# EAGLE design ARM-LPC1115_V0.18_smd (EAGLE 6.5.0)
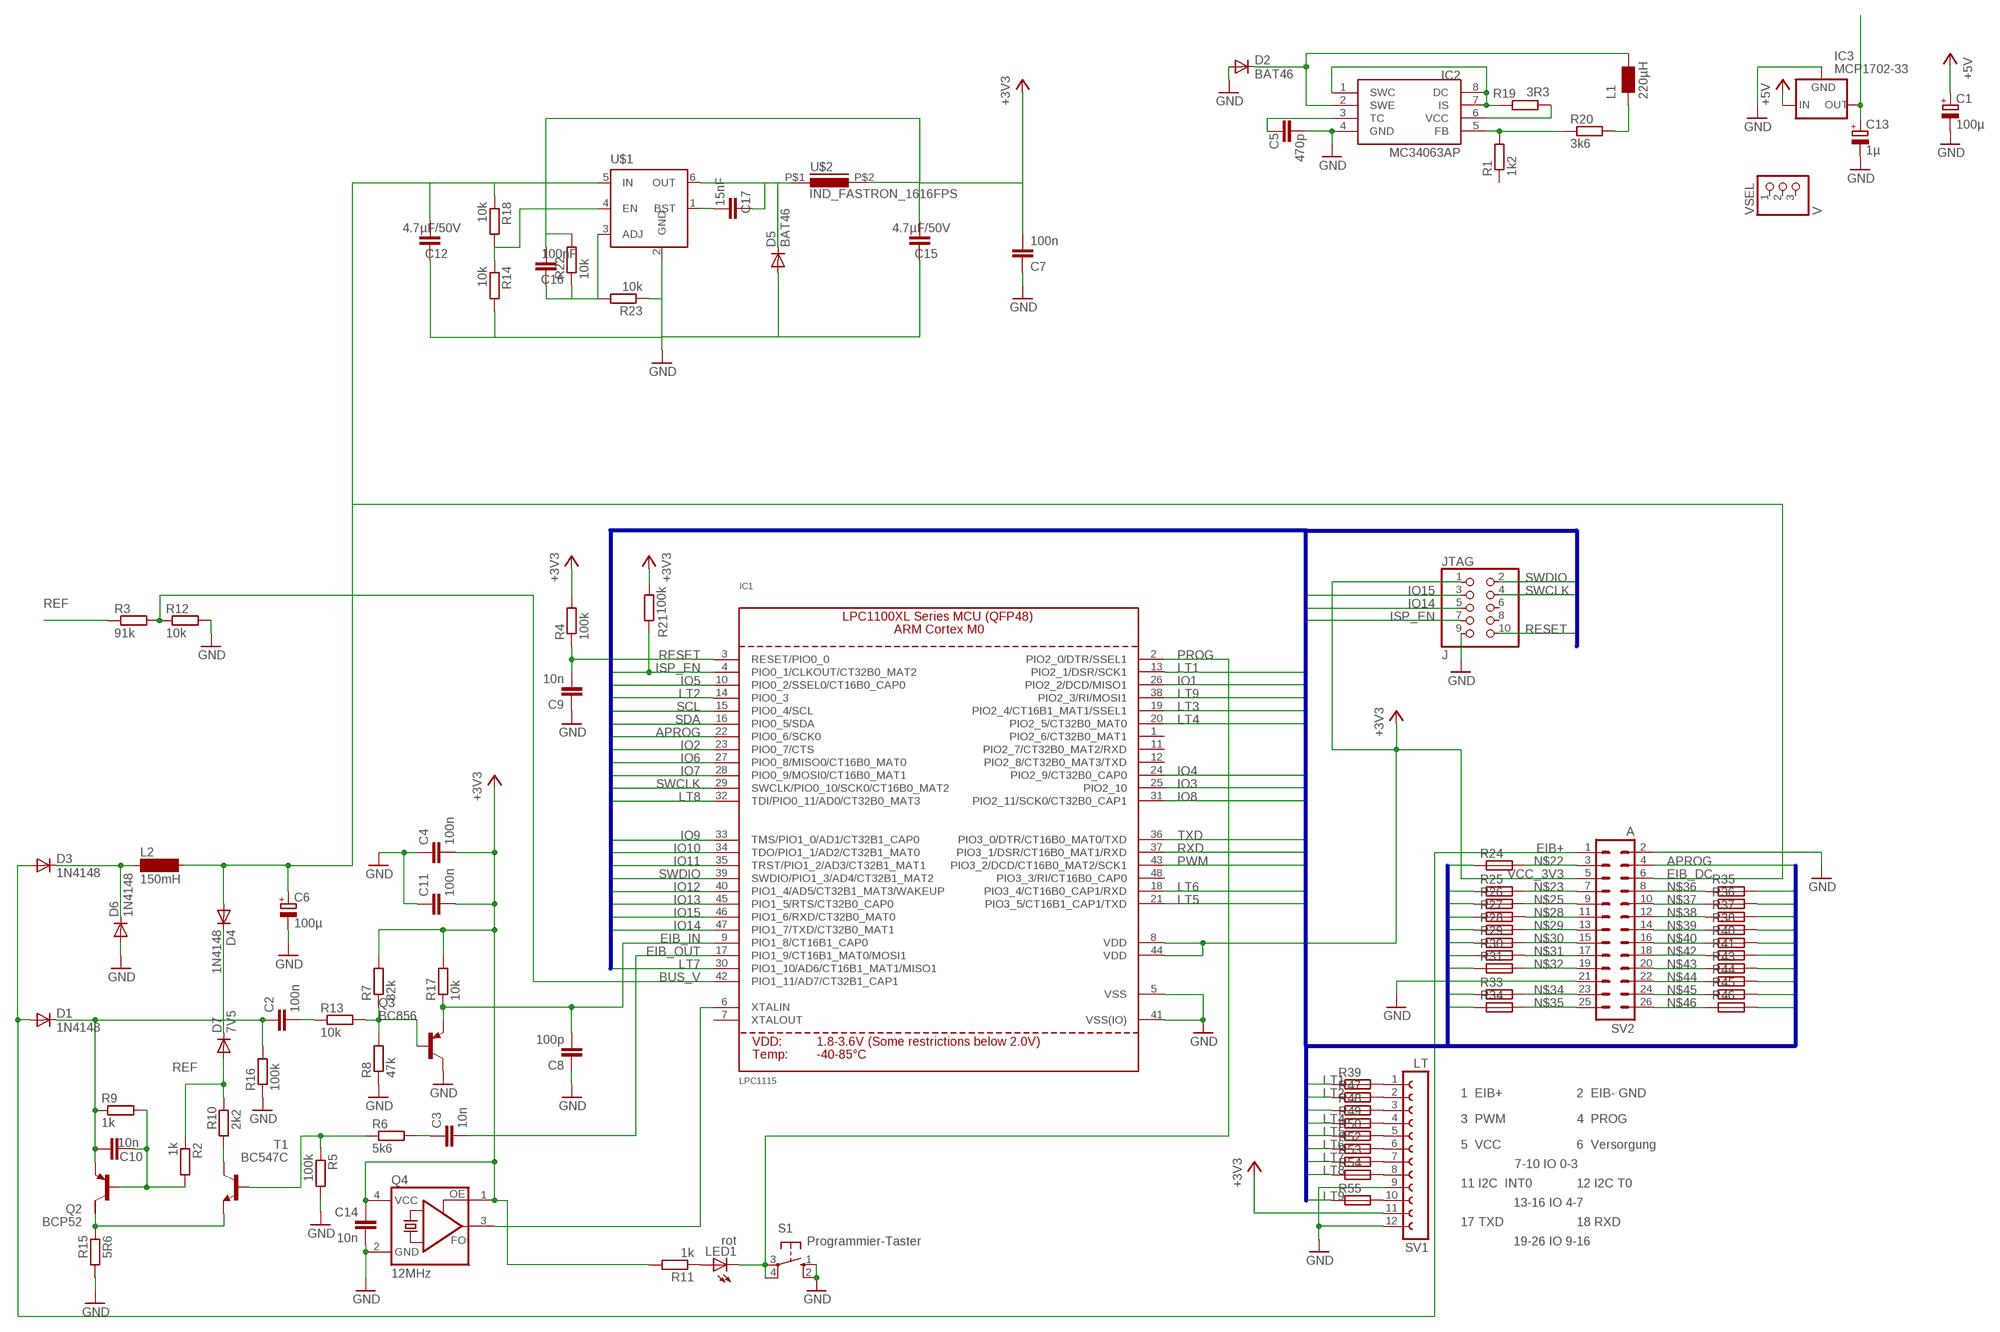
[diagram p0: schematic, sheet 1]

## Parts
C1  100µ  CPOL-EUE5-8.5  [E5-8,5]
C2  100n  C-EUC1206K  [C1206K]
C3  10n  C-EUC1206K  [C1206K]
C4  100n  C-EUC1206  [C1206]
C5  470p  C-EU025-024X044  [C025-024X044]
C6  100µ  CPOL-EUE5-8.5  [E5-8,5]
C7  100n  C-EUC1206  [C1206]
C8  100p  C-EUC1206K  [C1206K]
C9  10n  C-EUC1206K  [C1206K]
C10  10n  C-EUC1206K  [C1206K]
C11  100n  C-EUC1206  [C1206]
C12  4.7µF/50V  C-EUC1206K  [C1206K]
C13  1µ  CPOL-EUE2-4  [E2-4]
C14  10n  C-EUC1206  [C1206]
C15  4.7µF/50V  C-EUC1206K  [C1206K]
C16  100nF  C-EUC1206  [C1206]
C17  15nF  C-EUC1206  [C1206]
D1  1N4148  DIODE-MINIMELF  [MINIMELF]
D2  BAT46  DIODE-D-7.5  [D-7.5]
D3  1N4148  DIODE-MINIMELF  [MINIMELF]
D4  1N4148  DIODE-MINIMELF  [MINIMELF]
D5  BAT46  DIODE-DO214AC  [DO214AC]
D6  1N4148  DIODE-MINIMELF  [MINIMELF]
D7  7V5  DIODE-MINIMELF  [MINIMELF]
IC1  LPC1115  LPC1113/4/5_QFP48_XLSERIES  [LQFP48]
IC2  MC34063AP  [DIL08]
IC3  MCP1702-33  79LXX  [79LXX]
JTAG  J  PINHD-2X05_2.00  [2X05M]
L1  220µH  L_R85  [L_RAD_D8RM5]
L2  150mH  SD12-1000  [SD12_1000]
LED1  rot  LED3MM  [LED3MM]
Q2  BCP52  FZT753SMD  [SOT223]
Q3  BC856  BC856BSMD  [SOT23-BEC]
Q4  12MHz  ASFL  [ASF]
R1  1k2  R-EU_0207/10  [0207/10]
R2  1k  R-EU_R1206  [R1206]
R3  91k  R-EU_R1206  [R1206]
R4  100k  R-EU_R1206  [R1206]
R5  100k  R-EU_R1206  [R1206]
R6  5k6  R-EU_R1206  [R1206]
R7  82k  R-EU_R1206  [R1206]
R8  47k  R-EU_R1206  [R1206]
R9  1k  R-EU_R1206  [R1206]
R10  2k2  R-EU_R1206  [R1206]
R11  1k  R-EU_R1206  [R1206]
R12  10k  R-EU_R1206  [R1206]
R13  10k  R-EU_R1206  [R1206]
R14  10k  R-EU_R1206  [R1206]
R15  5R6  R-EU_R1206  [R1206]
R16  100k  R-EU_R1206  [R1206]
R17  10k  R-EU_R1206  [R1206]
R18  10k  R-EU_R1206  [R1206]
R19  3R3  R-EU_0207/10  [0207/10]
R20  3k6  R-EU_0207/10  [0207/10]
R21  100k  R-EU_R1206  [R1206]
R22  10k  R-EU_R1206  [R1206]
R23  10k  R-EU_R1206  [R1206]
R24  R-EU_BRIDGER0603  [R0603_BRIDGE]
R25  R-EU_BRIDGER0603  [R0603_BRIDGE]
R26  R-EU_BRIDGER0603  [R0603_BRIDGE]
R27  R-EU_BRIDGER0603  [R0603_BRIDGE]
R28  R-EU_BRIDGER0603  [R0603_BRIDGE]
R29  R-EU_BRIDGER0603  [R0603_BRIDGE]
R30  R-EU_BRIDGER0603  [R0603_BRIDGE]
R31  R-EU_BRIDGER0603  [R0603_BRIDGE]
R33  R-EU_BRIDGER0603  [R0603_BRIDGE]
R34  R-EU_BRIDGER0603  [R0603_BRIDGE]
R35  R-EU_BRIDGER0603  [R0603_BRIDGE]
R36  R-EU_BRIDGER0603  [R0603_BRIDGE]
R37  R-EU_BRIDGER0603  [R0603_BRIDGE]
R38  R-EU_BRIDGER0603  [R0603_BRIDGE]
R39  R-EU_BRIDGER0603  [R0603_BRIDGE]
R40  R-EU_BRIDGER0603  [R0603_BRIDGE]
R41  R-EU_BRIDGER0603  [R0603_BRIDGE]
R43  R-EU_BRIDGER0603  [R0603_BRIDGE]
R44  R-EU_BRIDGER0603  [R0603_BRIDGE]
R45  R-EU_BRIDGER0603  [R0603_BRIDGE]
R46  R-EU_BRIDGER0603  [R0603_BRIDGE]
R47  R-EU_BRIDGER0603  [R0603_BRIDGE]
R48  R-EU_BRIDGER0603  [R0603_BRIDGE]
R49  R-EU_BRIDGER0603  [R0603_BRIDGE]
R50  R-EU_BRIDGER0603  [R0603_BRIDGE]
R52  R-EU_BRIDGER0603  [R0603_BRIDGE]
R53  R-EU_BRIDGER0603  [R0603_BRIDGE]
R54  R-EU_BRIDGER0603  [R0603_BRIDGE]
R55  R-EU_BRIDGER0603  [R0603_BRIDGE]
S1  Programmier-Taster  10-XX  [B3F-10XX]
SV1  LT  FE12-1  [FE12]
SV2  A  ML26  [ML26]
T1  BC547C  BC847  [SOT23]
U$1  BD9G101GBD9G101G-SOT23-6  [SOT23-6]
U$2  IND_FASTRON_1616FPS  [PIS2812]
VSEL  V  HEADER-1X3ROUND  [1X03_ROUND]

## Nets
+5V: C1.+
APROG: IC1.22(PIO0_6/SCK0) SV2.4
BUS_V: IC1.42(PIO1_11/AD7/CT32B1_CAP1) R3.2 R12.1
DRAIN: C2.1 C10.1 D1.C Q2.3(E) R9.1 R16.2
EIB+: D1.A D3.A SV2.1
EIB_DC: C6.+ C12.2 D4.A L2.2 R18.1 SV2.6 U$1.5(IN)
EIB_IN: C8.2 IC1.9(PIO1_8/CT16B1_CAP0) Q3.E R17.1
EIB_OUT: C3.2 IC1.17(PIO1_9/CT16B1_MAT0/MOSI1)
GND: C1.- C4.1 C5.2 C6.- C7.1 C8.1 C9.1 C11.1 C12.1 C13.- C14.2 C15.1 D2.A D5.A D6.A IC1.5(VSS) IC1.41(VSS(IO)) IC2.4(GND) IC3.GND JTAG.9 Q3.C Q4.2(GND) R5.2 R8.1 R12.2 R14.2 R15.1 R16.1 R23.1 S1.1(S) S1.2(S1) SV1.9 SV1.12 SV2.2 SV2.21 U$1.2(GND)
IO1: IC1.26(PIO2_2/DCD/MISO1) R25.1
IO2: IC1.23(PIO0_7/CTS) R35.2
IO3: IC1.25(PIO2_10) R26.1
IO4: IC1.24(PIO2_9/CT32B0_CAP0) R36.2
IO5: IC1.10(PIO0_2/SSEL0/CT16B0_CAP0) R28.1
IO6: IC1.27(PIO0_8/MISO0/CT16B0_MAT0) R38.2
IO7: IC1.28(PIO0_9/MOSI0/CT16B0_MAT1) R29.1
IO8: IC1.31(PIO2_11/SCK0/CT32B0_CAP1) R40.2
IO9: IC1.33(TMS/PIO1_0/AD1/CT32B1_CAP0) R31.1
IO10: IC1.34(TDO/PIO1_1/AD2/CT32B1_MAT0) R43.2
IO11: IC1.35(TRST/PIO1_2/AD3/CT32B1_MAT1) R44.2
IO12: IC1.40(PIO1_4/AD5/CT32B1_MAT3/WAKEUP) R33.1
IO13: IC1.45(PIO1_5/RTS/CT32B0_CAP0) R45.2
IO14: IC1.47(PIO1_7/TXD/CT32B0_MAT1) JTAG.5 R34.1
IO15: IC1.46(PIO1_6/RXD/CT32B0_MAT0) JTAG.3 R46.2
ISP_EN: IC1.4(PIO0_1/CLKOUT/CT32B0_MAT2) JTAG.7 R21.1
LT1: IC1.13(PIO2_1/DSR/SCK1) R39.1
LT2: IC1.14(PIO0_3) R47.1
LT3: IC1.19(PIO2_4/CT16B1_MAT1/SSEL1) R48.1
LT4: IC1.20(PIO2_5/CT32B0_MAT0) R49.1
LT5: IC1.21(PIO3_5/CT16B1_CAP1/TXD) R50.1
LT6: IC1.18(PIO3_4/CT16B0_CAP1/RXD) R52.1
LT7: IC1.30(PIO1_10/AD6/CT16B1_MAT1/MISO1) R53.1
LT8: IC1.32(TDI/PIO0_11/AD0/CT32B0_MAT3) R54.1
LT9: IC1.38(PIO2_3/RI/MOSI1) R55.1
LX: C17.1 D5.C U$1.6(OUT) U$2.P$1
N$1: C3.1 R6.2
N$2: C2.2 R13.1
N$3: IC2.5(FB) R1.2 R20.1
N$4: IC2.1(SWC) IC2.7(IS) IC2.8(DC) R19.1
N$6: R10.1 T1.3(C)
N$7: Q2.2(C) R15.2 T1.2(E)
N$8: D3.C D6.C L2.1
N$9: D4.C D7.C
N$10: D2.C IC2.2(SWE) L1.1
N$11: IC2.6(VCC) R19.2
N$12: R5.1 R6.1 T1.1(B)
N$13: C5.1 IC2.3(TC)
N$14: Q3.B R7.1 R8.2 R13.2
N$15: C10.2 Q2.1(B) R2.2 R9.2
N$16: C13.+ IC3.OUT
N$17: IC1.6(XTALIN) Q4.3(FO)
N$19: C17.2 U$1.1(BST)
N$20: R14.1 R18.2 U$1.4(EN)
N$22: R24.2 SV2.3
N$23: R25.2 SV2.7
N$24: C16.1 R22.1 R23.2 U$1.3(ADJ)
N$25: R26.2 SV2.9
N$28: R27.2 SV2.11
N$29: R28.2 SV2.13
N$30: R29.2 SV2.15
N$31: R30.2 SV2.17
N$32: R31.2 SV2.19
N$34: R33.2 SV2.23
N$35: R34.2 SV2.25
N$36: R35.1 SV2.8
N$37: R36.1 SV2.10
N$38: R37.1 SV2.12
N$39: R38.1 SV2.14
N$40: R40.1 SV2.16
N$41: LED1.A R11.1
N$42: R41.1 SV2.18
N$43: R43.1 SV2.20
N$44: R44.1 SV2.22
N$45: R45.1 SV2.24
N$46: R46.1 SV2.26
N$47: R39.2 SV1.1
N$48: R47.2 SV1.2
N$49: R48.2 SV1.3
N$50: R49.2 SV1.4
N$51: R50.2 SV1.5
N$52: R52.2 SV1.6
N$53: R53.2 SV1.7
N$54: R54.2 SV1.8
N$55: R55.2 SV1.10
PROG: IC1.2(PIO2_0/DTR/SSEL1) LED1.K(C) S1.3(P) S1.4(P1)
PWM: IC1.43(PIO3_2/DCD/CT16B0_MAT2/SCK1) R24.1
REF: D7.A R2.1 R3.1 R10.2
RESET: C9.2 IC1.3(RESET/PIO0_0) JTAG.10 R4.1
RXD: IC1.37(PIO3_1/DSR/CT16B0_MAT1/RXD) R41.2
SCL: IC1.15(PIO0_4/SCL) R37.2
SDA: IC1.16(PIO0_5/SDA) R27.1
SWCLK: IC1.29(SWCLK/PIO0_10/SCK0/CT16B0_MAT2) JTAG.4
SWDIO: IC1.39(SWDIO/PIO1_3/AD4/CT32B1_MAT2) JTAG.2
TXD: IC1.36(PIO3_0/DTR/CT16B0_MAT0/TXD) R30.1
VCC_3V3: C4.2 C7.2 C11.2 C14.1 C15.2 C16.2 IC1.8(VDD) IC1.44(VDD) JTAG.1 Q4.1(OE) Q4.4(VCC) R4.2 R7.2 R11.2 R17.2 R21.2 R22.2 SV1.11 SV2.5 U$2.P$2 ; supply symbol labelled +3V3
VCC_5V: IC3.IN L1.2 R20.2 ; supply symbol labelled +5V
Unconnected: IC1.1(PIO2_6/CT32B0_MAT1) IC1.7(XTALOUT) IC1.11(PIO2_7/CT32B0_MAT2/RXD) IC1.12(PIO2_8/CT32B0_MAT3/TXD) IC1.48(PIO3_3/RI/CT16B0_CAP0) JTAG.6 JTAG.8 Q2.4(C/) R1.1 VSEL.1 VSEL.2 VSEL.3

## Buses
IO[1..15],LT[1..9],SCL,SDA,PWM,APROG,RXD,TXD,RESET,SWCLK,SWDIO,ISP_EN

## Notes on the sheet
- 1  EIB+ | 2  EIB- GND
- 3  PWM | 4  PROG
- 5  VCC | 6  Versorgung
- 7-10 IO 0-3
- 11 I2C  INT0 | 12 I2C T0
- 13-16 IO 4-7
- 17 TXD | 18 RXD
- 19-26 IO 9-16

## Library data of the parts
C1 C6 C13 = rcl:CPOL-EU: POLARIZED CAPACITOR, European symbol
C2-C5 C7-C12 C14-C17 = rcl:C-EU: CAPACITOR, European symbol
D1-D7 = diode:DIODE-: DIODE
IC1 = microbuilder:LPC1113/4/5_QFP48_XLSERIES: LPC1113/4/5 ARM Cortex M0 MCU (50MHz) - XL Series (FBD48/3x3) LPC1115FBD48/303: Max Frequency: 50MHz Flash: 64kB SRAM: 8kB ADC: 10-bit
IC2 = mc34063:MC34063
IC3 = v-reg:79LXX: VOLTAGE REGULATOR
JTAG = pinhead-2:PINHD-2X05: PIN HEADER
L1 = fbctrls1:L
L2 = inductor-neosid:SD12: INDUCTOR nominal inductance
LED1 = led:LED: LED OSRAM: - CHIPLED LG R971, LG N971, LY N971, LG Q971, LY Q971, LO R971, LY R971 LH N974, LH R974 LS Q976, LO Q976, LY Q976 LO Q996 - Hyper CHIPLED LW Q18S LB Q993, LB Q99A, LB R99A - SideLED LS A670, LO A670, LY A670, LG A670, LP A670 LB A673, LV A673, LT A673, LW A673 LH A674 LY A675 LS A676, LA A676, LO A676, LY A676, LW A676 LS A679, LY A679, LG A679 - Hyper Micro SIDELED® LS Y876, LA Y876, LO Y876, LY Y876 LT Y87S - SmartLED LW L88C, LW L88S LB L89C, LB L89S, LG L890 LS L89K, LO L89K, LY L89K LS L896, LA L896, LO L896, LY L896 - TOPLED LS T670, LO T670, LY T670, LG T670, LP T670 LSG T670, LSP T670, LSY T670, LOP T670, LYG T670 LG T671, LOG T671, LSG T671 LB T673, LV T673, LT T673, LW T673 LH T674 LS T676, LA T676, LO T676, LY T676, LB T676, LH T676, LSB T676, LW T676 LB T67C, LV T67C, LT T67C, LS T67K, LO T67K, LY T67K, LW E67C LS E67B, LA E67B, LO E67B, LY E67B, LB E67C, LV E67C, LT E67C LW T67C LS T679, LY T679, LG T679 LS T770, LO T770, LY T770, LG T770, LP T770 LB T773, LV T773, LT T773, LW T773 LH T774 LS E675, LA E675, LY E675, LS T675 LS T776, LA T776, LO T776, LY T776, LB T776 LHGB T686 LT T68C, LB T68C - Hyper Mini TOPLED® LB M676 - Mini TOPLED Santana® LG M470 LS M47K, LO M47K, LY M47K Source: http://www.osram.convergy.de - LUMILED® LXK2-PW12-R00, LXK2-PW12-S00, LXK2-PW14-U00, LXK2-PW14-V00 LXK2-PM12-R00, LXK2-PM12-S00, LXK2-PM14-U00 LXK2-PE12-Q00, LXK2-PE12-R00, LXK2-PE12-S00, LXK2-PE14-T00, LXK2-PE14-U00 LXK2-PB12-K00, LXK2-PB12-L00, LXK2-PB12-M00, LXK2-PB14-N00, LXK2-PB14-P00, LXK2-PB14-Q00 LXK2-PR12-L00, LXK2-PR12-M00, LXK2-PR14-Q00, LXK2-PR14-R00 LXK2-PD12-Q00, LXK2-PD12-R00, LXK2-PD12-S00 LXK2-PH12-R00, LXK2-PH12-S00 LXK2-PL12-P00, LXK2-PL12-Q00, LXK2-PL12-R00 Source: www.luxeon.com
Q2 = transistor-pnp:FZT753SMD: PNP Transistor
Q3 = transistor-pnp:BC856*: PNP Transistror
Q4 = crystal:ASF*: CRYSTAL CLOCK OSCILLATORS 5.0 Vdc or 3.3 Vdc - LOW PROFILE ULTRA MINIATURE CERAMIC SURFACE MOUNT Source: http://www.abracon.com/Oscillators/asf1-L-L1.pdf
R1-R23 = rcl:R-EU_: RESISTOR, European symbol
R24-R31 R33-R41 R43-R50 R52-R55 = Stefan_selfbus:R-EU_BRIDGE: RESISTOR, European symbol
S1 = switch-omron:10-XX: OMRON SWITCH
SV1 = con-lsta:FE12-1: FEMALE HEADER; OC_FARNELL: unknown; OC_NEWARK: unknown
SV2 = con-harting-ml:ML26: HARTING; OC_FARNELL: unknown; OC_NEWARK: unknown
T1 = transistor:BC847: NPN TRANSISTOR
U$1 = Stefan_selfbus:BD9G101G
U$2 = Stefan_selfbus:IND_FASTRON_1616FPS
VSEL = microbuilder:HEADER-1X3: PIN HEADER

## Board
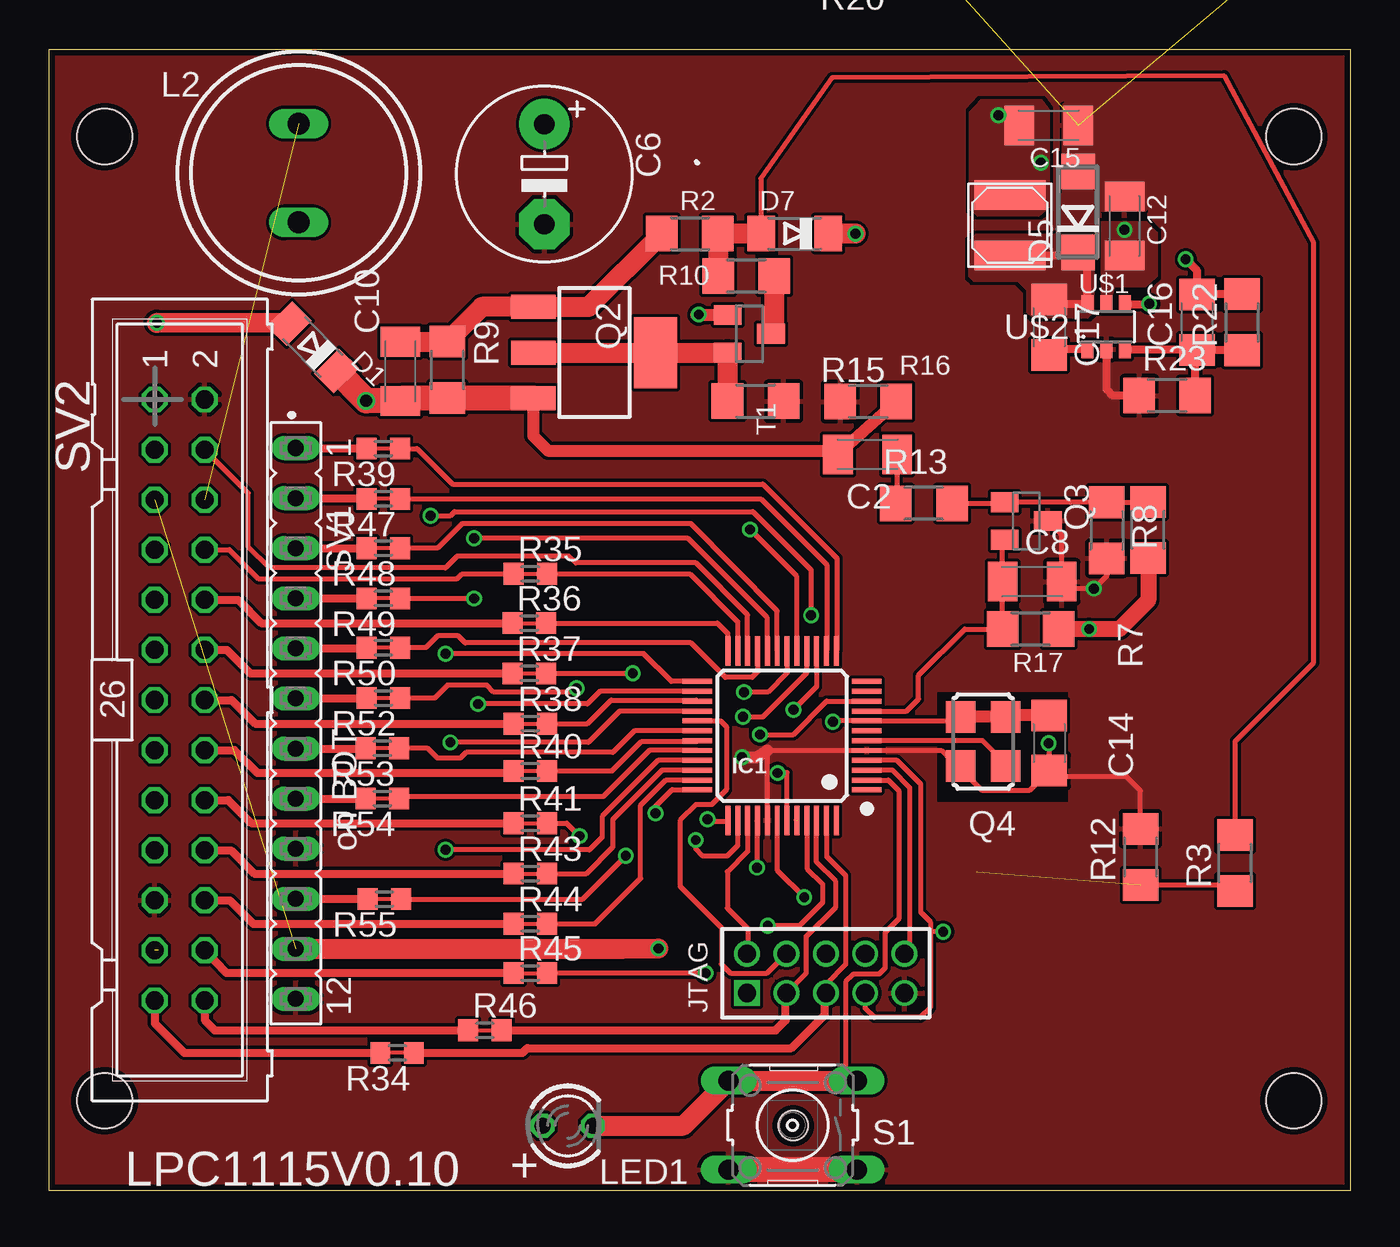
[diagram p1: board, top side]
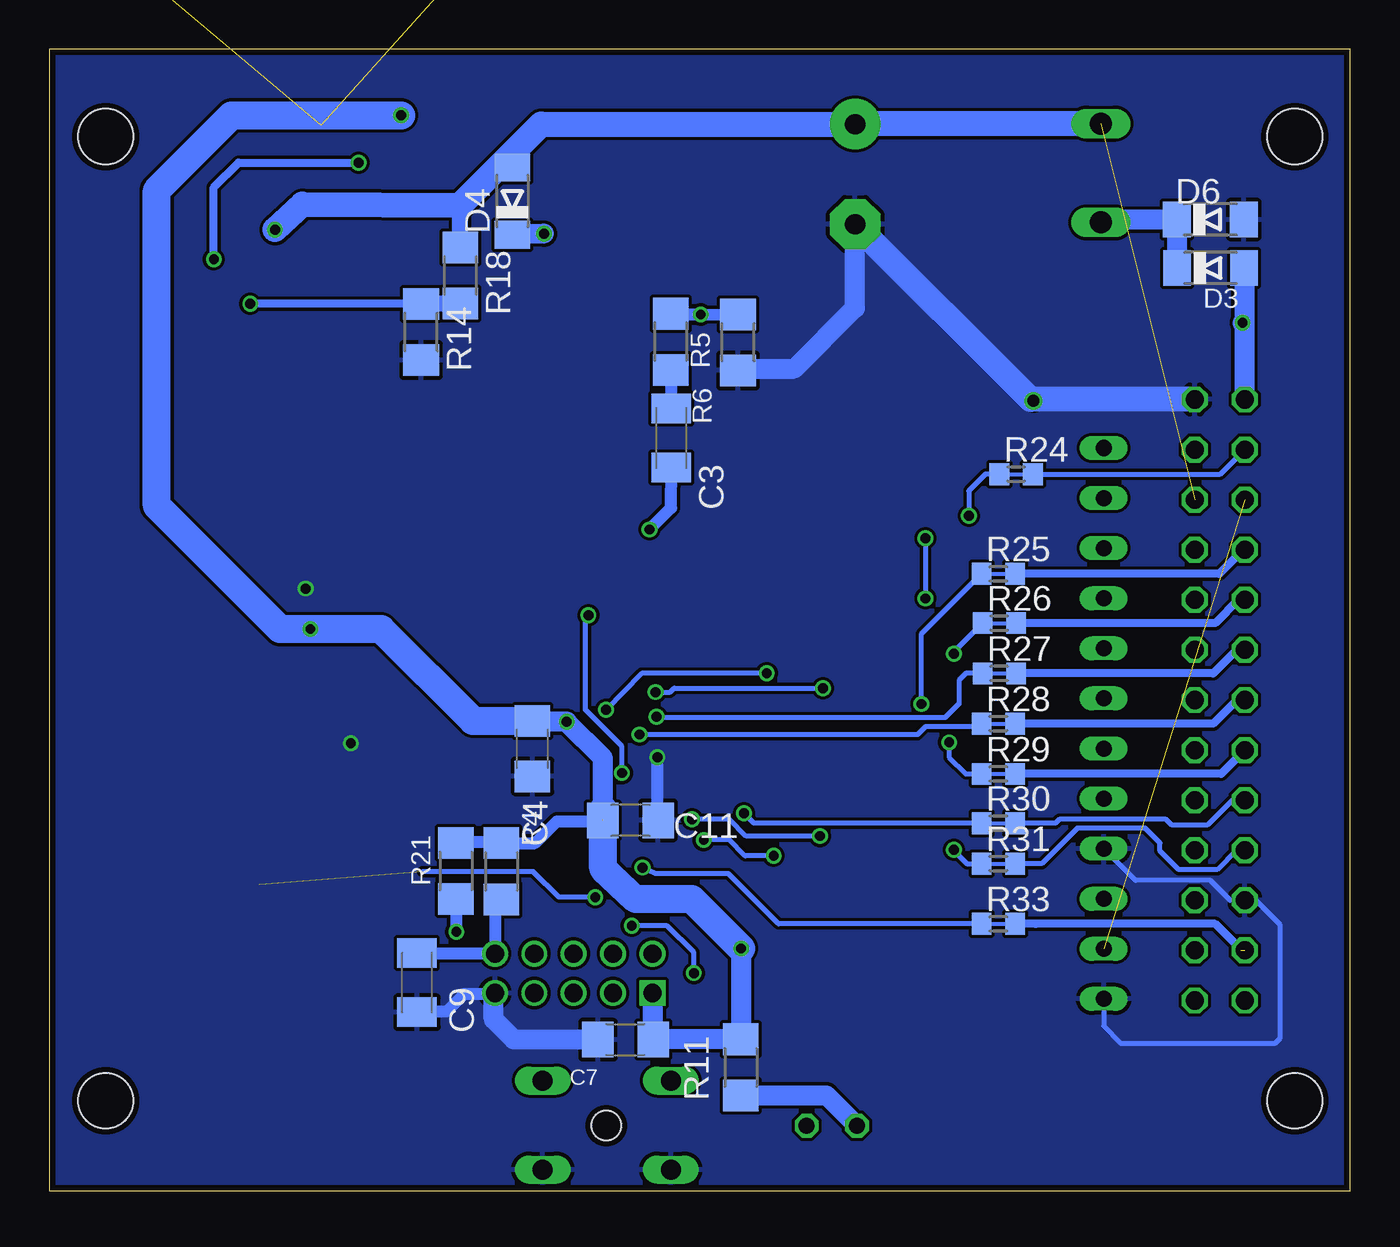
[diagram p2: board, bottom side, seen from below]

Size 66 x 57.9 mm. Coordinates in mm from the lower left corner, seen from the top.
Outline: 0,57.9 66,57.9
Outline: 0,57.9 0,0 66,0 66,57.9
Outline: 0,57.9 66,57.9
Copper layers (1*16): Top 0.035mm / dielectric 1.5mm / Bottom 0.035mm
Design rules "default *": minimum track width 0.16mm, minimum drill 0.3mm, track to track 0.16mm, track to pad 0.16mm, pad to pad 0.16mm, via to via 0.16mm, smd to smd 0.16mm, copper to edge 0.3mm, drill to drill 0.2mm, minimum pad ring 0.2mm, minimum via ring 0.15mm, stop-mask expansion 0.075mm, vias tented up to drill 0mil, thermal gap 0.2mm
Holes 2.8 mm at 2.81,53.48 63.14,53.48 63.14,4.58 2.81,4.58
Holes 1.5 mm at 37.73,3.31
tRestrict: area 45.1,19.7 to 51.7,25.3

### Footprints (pad centres in the part's own frame; a part is rotated, then mirrored left to right if it is on the bottom)
E5-8,5 = drill 1.016 pad 2.54: + -2.54,0 | drill 1.016 pad 2.54 octagon: - 2.54,0
C1206K = smd 1.5 x 2: 1 -1.5,0; 2 1.5,0
C1206 = smd 1.6 x 1.8: 1 -1.4,0; 2 1.4,0
C025-024X044 = drill 0.813 octagon: 1 -1.27,0; 2 1.27,0
E2-4 = drill 0.813 pad 1.27: + -1.016,0 | drill 0.813 pad 1.27 octagon: - 1.016,0
MINIMELF = smd 1.4 x 1.8: A 1.7,0; C -1.7,0
D-7.5 = drill 0.813 long: A 3.81,0; C -3.81,0
DO214AC = smd 1.8 x 1.7: A 2.05,0; C -2.05,0
LQFP48 = smd 1.5 x 0.25: 1 -4.3,2.75; 2 -4.3,2.25; 3 -4.3,1.75; 4 -4.3,1.25; 5 -4.3,0.75; 6 -4.3,0.25; 7 -4.3,-0.25; 8 -4.3,-0.75; 9 -4.3,-1.25; 10 -4.3,-1.75; 11 -4.3,-2.25; 12 -4.3,-2.75; 25 4.3,-2.75; 26 4.3,-2.25; 27 4.3,-1.75; 28 4.3,-1.25; 29 4.3,-0.75; 30 4.3,-0.25; 31 4.3,0.25; 32 4.3,0.75; 33 4.3,1.25; 34 4.3,1.75; 35 4.3,2.25; 36 4.3,2.75 | smd 0.25 x 1.5: 13 -2.75,-4.3; 14 -2.25,-4.3; 15 -1.75,-4.3; 16 -1.25,-4.3; 17 -0.75,-4.3; 18 -0.25,-4.3; 19 0.25,-4.3; 20 0.75,-4.3; 21 1.25,-4.3; 22 1.75,-4.3; 23 2.25,-4.3; 24 2.75,-4.3; 37 2.75,4.3; 38 2.25,4.3; 39 1.75,4.3; 40 1.25,4.3; 41 0.75,4.3; 42 0.25,4.3; 43 -0.25,4.3; 44 -0.75,4.3; 45 -1.25,4.3; 46 -1.75,4.3; 47 -2.25,4.3; 48 -2.75,4.3
DIL08 = drill 0.813 long: 1 -3.81,-3.81; 2 -1.27,-3.81; 3 1.27,-3.81; 4 3.81,-3.81; 5 3.81,3.81; 6 1.27,3.81; 7 -1.27,3.81; 8 -3.81,3.81
79LXX = drill 0.813 octagon: GND -1.27,0; IN 0,1.905; OUT 1.27,0
2X05M = drill 0.914 square: 1 -4,-1 | drill 0.914: 2 -4,1; 3 -2,-1; 4 -2,1; 5 0,-1; 6 0,1; 7 2,-1; 8 2,1; 9 4,-1; 10 4,1
L_RAD_D8RM5 = drill 1: 1 -2.5,0; 2 2.5,0
SD12_1000 = drill 1.1 long: 1 -2.5,0; 2 2.5,0
LED3MM = drill 0.813 octagon: A -1.27,0; K 1.27,0
SOT223 = smd 1.219 x 2.235: 1 -2.311,-3.099; 2 0,-3.099; 3 2.311,-3.099 | smd 3.6 x 2.2: 4 0,3.099
SOT23-BEC = smd 1 x 1.4: B -0.95,-1.1; C 0,1.1; E 0.95,-1.1
ASF = smd 1.6 x 1.5: 1 -1.25,-1.15; 2 1.25,-1.15; 3 1.25,1.15; 4 -1.25,1.15
0207/10 = drill 0.813 octagon: 1 -5.08,0; 2 5.08,0
R1206 = smd 1.6 x 1.803: 1 -1.422,0; 2 1.422,0
R0603_BRIDGE = smd 1 x 1.1: 1 -0.85,0; 2 0.85,0
B3F-10XX = drill 1.016 long: 1 -3.251,2.261; 2 3.251,2.261; 3 -3.251,-2.261; 4 3.251,-2.261
FE12 = drill 0.813 long: 1 -13.97,0; 2 -11.43,0; 3 -8.89,0; 4 -6.35,0; 5 -3.81,0; 6 -1.27,0; 7 1.27,0; 8 3.81,0; 9 6.35,0; 10 8.89,0; 11 11.43,0; 12 13.97,0
ML26 = drill 0.914 octagon: 1 -15.24,-1.27; 2 -15.24,1.27; 3 -12.7,-1.27; 4 -12.7,1.27; 5 -10.16,-1.27; 6 -10.16,1.27; 7 -7.62,-1.27; 8 -7.62,1.27; 9 -5.08,-1.27; 10 -5.08,1.27; 11 -2.54,-1.27; 12 -2.54,1.27; 13 0,-1.27; 14 0,1.27; 15 2.54,-1.27; 16 2.54,1.27; 17 5.08,-1.27; 18 5.08,1.27; 19 7.62,-1.27; 20 7.62,1.27; 21 10.16,-1.27; 22 10.16,1.27; 23 12.7,-1.27; 24 12.7,1.27; 25 15.24,-1.27; 26 15.24,1.27
SOT23 = smd 1 x 1.4: 1 -0.95,-1.1; 2 0.95,-1.1; 3 0,1.1
SOT23-6 = smd 0.6 x 0.9: 1 -0.95,-1.15; 2 0,-1.15; 3 0.95,-1.15; 4 0.95,1.15; 5 0,1.15; 6 -0.95,1.15
PIS2812 = smd 3.6 x 1.5: P$1 0,1.525; P$2 0,-1.525
1X03_ROUND = drill 1 pad 1.676: 1 -2.54,0; 2 0,0; 3 2.54,0

### Placement (x,y rotation side)
C1  70.96,72.38 270 top  (outside the outline)
C2  41.51,37.35 0 top
C3  34.44,38.19 270 bottom
C4  41.48,22.43 90 bottom
C5  42.82,65.78 270 top  (outside the outline)
C6  25.11,51.57 270 top
C7  36.77,7.68 0 bottom
C8  49.86,30.9 180 top
C9  47.35,10.57 90 bottom
C10  17.81,41.57 90 top
C11  36.51,18.79 180 bottom
C12  54.55,48.94 270 top
C13  86,75.94 270 top  (outside the outline)
C14  50.73,22.72 270 top
C15  50.7,54.04 180 top
C16  58.24,44.06 90 top
C17  50.72,43.8 270 top
D1  13.37,42.8 135 top
D2  39.42,73.51 270 top  (outside the outline)
D3  7.08,46.81 0 bottom
D4  42.51,50.2 90 bottom
D5  52.2,49.65 90 top
D6  7.1,49.27 0 bottom
D7  37.82,48.55 180 top
IC1  37.18,23.09 180 top
IC2  49.24,70.7 270 top  (outside the outline)
IC3  79.01,75.14 0 top  (outside the outline)
JTAG  39.39,11.04 0 top
L1  33.37,67.11 180 top  (outside the outline)
L2  12.65,51.63 90 top
LED1  26.3,3.31 0 top
Q2  27.65,42.52 270 top
Q3  49.56,33.98 270 top
Q4  47.38,22.8 270 top
R1  55.12,64.27 0 top  (outside the outline)
R2  32.5,48.55 180 top
R3  60.16,16.63 270 top
R4  43.06,16.21 90 bottom
R5  31.06,43.03 270 bottom
R6  34.46,43.07 270 bottom
R7  55.73,33.53 270 top
R8  53.65,33.51 90 top
R9  20.19,41.65 90 top
R10  35.35,46.41 180 top
R11  30.91,6.27 90 bottom
R12  55.35,16.95 90 top
R13  44.37,34.88 0 top
R14  47.14,43.56 270 bottom
R15  35.83,40.05 180 top
R16  41.55,40.03 0 top
R17  49.79,28.5 0 top
R18  45.14,46.42 270 bottom
R19  49.17,77.27 180 top  (outside the outline)
R20  44.96,62.21 180 top  (outside the outline)
R21  45.37,16.23 90 bottom
R22  60.51,44.06 90 top
R23  56.72,40.34 0 top
R24  16.95,36.35 0 bottom
R25  17.85,31.3 0 bottom
R26  17.8,28.8 0 bottom
R27  17.8,26.25 0 bottom
R28  17.85,23.7 0 bottom
R29  17.85,21.15 0 bottom
R30  17.85,18.65 0 bottom
R31  17.85,16.6 0 bottom
R33  17.85,13.55 0 bottom
R34  17.65,7 180 top
R35  24.4,31.3 0 top
R36  24.35,28.8 0 top
R37  24.35,26.25 0 top
R38  24.4,23.7 0 top
R39  16.95,37.65 180 top
R40  24.4,21.3 0 top
R41  24.4,18.65 0 top
R43  24.4,16.1 0 top
R44  24.4,13.55 0 top
R45  24.4,11.05 0 top
R46  22.1,8.15 0 top
R47  16.95,35.1 180 top
R48  16.95,32.6 180 top
R49  16.95,30.05 180 top
R50  16.95,27.55 180 top
R52  16.95,25 180 top
R53  16.9,22.45 180 top
R54  16.9,19.9 180 top
R55  17,14.8 180 top
S1  37.72,3.34 180 top
SV1  12.51,23.71 270 top
SV2  6.62,24.9 270 top
T1  35.51,43.47 270 top
U$1  53.62,43.83 0 top
U$2  48.74,48.98 180 top
VSEL  80.77,71.3 180 top  (outside the outline)

### Tracks (layer width: path | path; a pad name or v marks a point on that pad's centre or on a via)
APROG
  Top 0.254: IC1.22 35.43,29.22 32.8,31.85 26.7,31.85 26.35,32.2 20.7,32.2 20.1,31.6 11.15,31.6 10.1,32.65 10.1,35.39 SV2.4
BUS_V  (via drill 0.5)  (1 unrouted)
  Top 0.254: IC1.42 36.93,16.27 v38.3,14.9 | R12.1 59.84,15.52 R3.2
  Bottom 0.254: v38.3,14.9 40.15,14.9 41.45,16.2 47.05,16.2
DRAIN  (via drill 0.6)
  Top 0.61: Q2.3 24.56,38.29 25.3,37.55 39.81,37.55 C2.1 40.12,37.46 R16.2
  Top 1.016: 20.21,40.21 R9.1
  Top 1.27: Q2.3 20.21,40.21 17.95,40.21 C10.1 v16.08,40.07 D1.C
EIB+  (via drill 0.5)
  Top 1.016: D1.A v5.46,44.03
  Bottom 1.016: D3.A 5.38,44.11 | 5.38,44.11 5.38,40.17 SV2.1 | v5.46,44.03 5.38,44.11
EIB_DC  (via drill 0.5)  (1 unrouted)
  Bottom 0.813: R18.1 45.15,50 | D4.A 42.51,52.11 42.77,52.38
  Bottom 1.016: 25.1,54.13 C6.+
  Bottom 1.27: L2.2 25.1,54.13 | v54.55,48.75 53.15,50.05 45.15,50 42.77,52.38 41.04,54.11 C6.+ | R18.1
  pour Top (no thermals): 53.4,45.1 53.4,49.15 55.65,49.15 56.2,48.6 56.2,46.4 55.6,45.85 54,45.85 53.8,45.1
EIB_IN
  Top 0.254: IC1.9 43.49,24.34 44.1,24.95 44.1,26.15 46.45,28.5 R17.1 C8.2 48.37,32.93 Q3.E
EIB_OUT  (via drill 0.5)
  Top 0.254: IC1.17 37.93,31.17 v35.55,33.55
  Bottom 0.61: v35.55,33.55 34.45,34.65 C3.2
GND  (via drill 0.5)  (6 unrouted)
  Top 0.254: C14.2 49.72,20.3 47.35,20.3 46.1,21.55 Q4.2 arc-90 45.73,21.84 45.7,21.9 45.26,22.34 IC1.5 36.43,22.35 IC1.41 | Q3.C 51.37,33.27 C8.1 51.72,30.55 v53,30.55 53.65,31.2 R8.1 | R12.2 55.35,20.3 54.65,21 51.05,21 C14.2 | 53.65,42.65 U$1.2 | C14.2 50.73,22.67 v50.7,22.7
  Top 0.406: R23.1 53.96,40.34 53.65,40.65 53.65,42.65
  Top 0.61: v35.15,22 35.9,22 36.43,22.35
  Top 1.27: S1.1 S1.2
  Bottom 0.254: SV1.9 10.9,15.75 7.1,15.75 6.09,14.74 SV2.21 4.8,14.74 3.55,13.49 3.55,7.75 3.8,7.5 11.65,7.5 12.51,8.36 SV1.12
  Bottom 0.61: C11.1 35.15,18.83 v35.15,22 | 43.45,9.98 44.97,9.98 45.85,9.1 47.38,9.1 C9.1
  Bottom 1.016: C7.1 42.43,7.68 43.45,8.7 43.45,9.98 JTAG.9 | R5.2 30.97,41.7 28.2,41.7 25.11,44.79 C6.-
  Bottom 1.27: SV2.2 16.22,40.14 C6.-
  pour Top (no thermals): 51.4,55.05 51.4,50.15 51.85,49.7 55.6,49.7 56,50.1 56,52.65 53.65,55.35 51.7,55.35
  pour Bottom (rank 6): -0.75,58.45 -0.9,-1.05 66.8,-1.05 66.7,58.6
  pour Top (rank 6): -0.75,58.45 -0.9,-1.05 66.8,-1.05 66.7,58.6
IO1  (via drill 0.5)
  Top 0.254: IC1.26 27.94,25.34 27.3,24.7 v21.75,24.7
  Bottom 0.254: v21.75,24.7 21.75,28.25 R25.1
IO2
  Top 0.254: R35.2 32.5,31.3 34.9,28.9 34.93,28.88 IC1.23
IO3  (via drill 0.5)
  Top 0.254: IC1.25 31.56,25.84 30.15,27.25 v20.1,27.25
  Bottom 0.254: v20.1,27.25 19.95,27.5 R26.1
IO4
  Top 0.254: R36.2 33.9,28.8 34.43,28.27 IC1.24
IO5  (via drill 0.5)
  Top 0.254: v36.05,23.15 37.75,23.15 39.44,24.84 IC1.10
  Bottom 0.254: R28.1 18.85,23.55 21.55,23.55 21.95,23.15 v36.05,23.15
IO6
  Top 0.254: R38.2 27.3,23.7 28.5,24.9 32.82,24.9 IC1.27
IO7  (via drill 0.5)
  Top 0.254: IC1.28 28.94,24.34 27.35,22.75 v20.35,22.75
  Bottom 0.254: v20.35,22.75 20.35,22 19.5,21.15 R29.1
IO8
  Top 0.254: R40.2 28.55,21.3 30.05,22.8 32.84,22.8 IC1.31
IO9  (via drill 0.5)
  Top 0.254: IC1.33 30.89,21.84 28.05,19 28.05,17.95 27.4,17.3 v20.1,17.3
  Bottom 0.254: v20.1,17.3 20.05,17.2 19.45,16.6 R31.1
IO10
  Top 0.254: R43.2 27.25,16.1 28.6,17.45 28.6,18.85 31.1,21.35 IC1.34
IO11
  Top 0.254: R44.2 27.7,13.55 30,15.85 30,19.55 31.3,20.85 IC1.35
IO12  (via drill 0.5)
  Top 0.254: 35.9,18.76 IC1.40 35.93,16.62 v35.9,16.4
  Bottom 0.254: v35.9,16.4 35.25,16.1 31.55,16.1 29,13.55 R33.1
IO13  (via drill 0.5)
  Top 0.254: v33.3,11.05 R45.2 | IC1.45 38.45,16.35 39.23,15.57 39.23,14.63 38.05,13.45 v36.45,13.45
  Bottom 0.254: v33.3,11.05 33.3,12.1 34.65,13.45 v36.45,13.45
IO14
  Top 0.254: IC1.47 39.43,16.97 40.4,16 40.4,11.5 39.39,10.49 JTAG.5
  Top 0.406: 39.35,10 39.35,8.95 37.65,7.25 24.25,7.25 24,7 R34.1
  Top 0.813: 39.35,10 JTAG.5
IO15
  Top 0.254: IC1.46 38.93,16.67 39.9,15.7 39.9,14.4 38.4,12.9 38.4,11.05 JTAG.3
  Top 0.406: R46.2 36.85,8.15 37.35,8.65 37.35,10
  Top 0.813: 37.35,10 JTAG.3
ISP_EN  (via drill 0.5)
  Top 0.254: IC1.4 43.01,21.84 44.2,20.65 44.2,14.15 44.7,13.65 44.7,13.1 | 44.7,13.1 44.7,9.3 44.2,8.8 41.85,8.8 41.4,9.25 JTAG.7 | v45.35,13.15 44.75,13.15 44.7,13.1
  Bottom 0.61: R21.1 45.37,13.17 v45.35,13.15
LT1
  Top 0.254: R39.1 18.65,37.65 20.45,35.85 36.2,35.85 39.95,32.1 39.95,27.41 IC1.13
LT2
  Top 0.254: R47.1 36.1,35.1 39.45,31.75 39.45,27.41 IC1.14
LT3
  Top 0.254: IC1.19 36.93,29.42 32.55,33.85 20.95,33.85 19.7,32.6 R48.1
LT4  (via drill 0.5)
  Top 0.254: IC1.20 36.43,29.07 32.4,33.1 v21.55,33.1 | R49.1 v21.55,30.05
  Bottom 0.254: v21.55,33.1 v21.55,30.05
LT5
  Top 0.254: IC1.21 35.93,26.33 35.65,26.05 34.3,26.05 32.55,27.8 21.1,27.8 20.75,28.15 19.7,28.15 19.1,27.55 R50.1
LT6  (via drill 0.5)
  Top 0.254: IC1.18 37.43,26.28 36.45,25.3 v35.25,25.3 | v26.75,25.5 26.75,25.3 22.55,25.3 22.2,25.65 20.2,25.65 19.55,25 R52.1
  Bottom 0.254: v35.25,25.3 34.5,25.3 34.3,25.5 v26.75,25.5
LT7
  Top 0.254: IC1.30 29.69,23.34 28.6,22.25 21.15,22.25 20.85,21.95 19.7,21.95 19.2,22.45 R53.1
LT8
  Top 0.254: IC1.32 30.44,22.34 28.1,20 17.85,20 R54.1
LT9  (via drill 0.5)
  Top 0.254: R55.1 27.05,14.8 v29.25,17 | v32.8,17.8 32.8,17.35 33.15,17 34.4,17 34.93,17.53 IC1.38
  Bottom 0.254: v29.25,17 30.7,17 31.5,17.8 v32.8,17.8
LX
  Top 0.254: 51.1,44.98 C17.1
  Top 0.406: 51.1,44.98 U$1.6 52.67,47.13 D5.C 52.05,47.45 U$2.P$1
  pour Top (no thermals): 53,44.9 53,48.45 52.95,48.5 47,48.5 46.65,48.15 46.65,46.4 46.9,46.15 49.15,46.15 49.6,45.7 49.6,44.6 49.9,44.3 52.7,44.3 53,44.6
N$1
  Bottom 0.254: 34.44,41.63 R6.2
  Bottom 0.61: C3.1 34.44,41.63
N$2
  Top 0.254: C2.2 43.01,34.94 R13.1
N$3  (2 unrouted)
N$4  (3 unrouted)
N$6
  Top 1.016: R10.1 36.78,43.64 T1.3
N$7
  Top 0.61: T1.2
  Top 1.016: Q2.2 T1.2 | T1.2 R15.2
N$8
  Bottom 1.016: D3.C 8.78,49.25 D6.C 12.51,49.27 L2.1
N$9  (via drill 0.5)
  Top 1.016: v40.9,48.55 40.07,48.55 D7.C
  Bottom 1.016: D4.C 42.19,48.56 v40.9,48.55
N$10  (2 unrouted)
N$11  (1 unrouted)
N$12  (via drill 0.5)
  Top 0.61: T1.1 32.83,44.42 v32.95,44.45
  Bottom 0.61: R6.1 34.63,44.44 R5.1 34.61,44.45 v32.95,44.45
N$13  (1 unrouted)
N$14
  Top 0.254: R7.1 55.81,34.93 R8.2 51.81,34.93 Q3.B 48.41,34.88 R13.2
N$15
  Top 1.016: C10.2 R9.2 21.96,44.83 Q2.1 27.35,44.83 R2.2
N$16  (1 unrouted)
N$17
  Top 0.254: Q4.3 48.53,21.66 47.35,22.84 | 47.35,22.84 | 47.35,22.84 44.99,22.84 IC1.6
N$19
  Top 0.254: 51.05,42.68 C17.2
  Top 0.406: U$1.1 51.05,42.68
N$20  (via drill 0.5)
  Top 0.406: U$1.4 55.78,44.98
  Top 0.61: 55.78,44.98 v55.8,45
  Bottom 0.406: R18.2 v55.8,45
  Bottom 0.813: R14.1 45.16,44.99 R18.2
N$22
  Bottom 0.254: R24.2 6.6,36.35 SV2.3
N$23
  Bottom 0.406: SV2.7 5.43,32.52 6.65,31.3 R25.2
N$24
  Top 0.254: 60.48,42.66 R22.1 | 54.59,42.66 U$1.3 | 58.14,42.56 C16.1
  Top 0.406: 60.48,42.66 C16.1 54.59,42.66 | R23.2 58.14,42.56
N$25
  Bottom 0.406: SV2.9 5.67,29.98 6.85,28.8 R26.2
N$28
  Bottom 0.406: SV2.11 5.76,27.44 6.95,26.25 R27.2
N$29
  Bottom 0.406: SV2.13 5.75,24.9 6.95,23.7 R28.2
N$30
  Bottom 0.406: SV2.15 6.55,21.15 R29.2
N$31
  Bottom 0.254: SV2.17 5.98,19.82 7.25,18.55 9.05,18.55 9.35,18.85 14.75,18.85 14.95,18.65 R30.2
N$32
  Bottom 0.254: SV2.19 5.77,17.28 6.75,16.3 8.7,16.3 9.65,17.25 9.65,17.65 10.4,18.4 13.85,18.4 15.65,16.6 R31.2
N$34  (1 unrouted)
  Bottom 0.406: 5.55,12.2 5.55,12.25 6.85,13.55 15.95,13.55 R33.2
N$35
  Top 0.406: SV2.25 5.35,8.5 6.85,7 R34.2
N$36
  Top 0.254: SV2.8 9.13,32.52 10.6,31.05 20.7,31.05 20.95,31.3 R35.1
N$37
  Top 0.406: SV2.10 9.57,29.98 10.75,28.8 R36.1
N$38
  Top 0.406: SV2.12 9.01,27.44 10.2,26.25 R37.1
N$39
  Top 0.406: SV2.14 9.25,24.9 10.45,23.7 R38.1
N$40
  Top 0.406: SV2.16 9.39,22.36 10.55,21.2 23.45,21.2 R40.1
N$41
  Bottom 1.016: R11.1 26.58,4.85 LED1.A
N$42
  Top 0.406: SV2.18 9.08,19.82 10.25,18.65 R41.1
N$43
  Top 0.406: SV2.20 9.22,17.28 10.4,16.1 R43.1
N$44
  Top 0.406: SV2.22 9.16,14.74 10.35,13.55 R44.1
N$45
  Top 0.406: R45.1 8.99,11.05 SV2.24
N$46
  Top 0.406: SV2.26 7.89,8.66 8.4,8.15 R46.1
N$47
  Top 0.406: R39.2 12.54,37.65 SV1.1
N$48
  Top 0.406: SV1.2 16.06,35.14 R47.2
N$49
  Top 0.406: SV1.3 R48.2
N$50
  Top 0.406: SV1.4 R49.2
N$51
  Top 0.406: SV1.5 16.07,27.52 R50.2
N$52
  Top 0.406: SV1.6 16.08,24.98 R52.2
N$53
  Top 0.406: SV1.7 R53.2
N$54
  Top 0.406: SV1.8 R54.2
N$55
  Top 0.406: SV1.10 16.13,14.82 R55.2
PROG
  Top 0.254: IC1.2 42.56,20.84 43.1,20.3 43.1,13.8 42.4,13.1 42.4,11.3 42.1,11 40.8,11 40.4,10.6 40.4,6.17 S1.3
  Top 1.016: LED1.K 32.17,3.31 S1.4 S1.3
PWM  (via drill 0.5)
  Top 0.254: IC1.43 37.43,21.22 v36.95,21.2 | v19.35,34.25 20.35,34.25 20.55,34.45 35.7,34.45 38.65,31.5 v38.65,29.2
  Bottom 0.254: R24.1 18.5,36.35 19.35,35.5 v19.35,34.25 | v36.95,21.2 36.95,22.55 38.8,24.4 38.8,29.05 v38.65,29.2
REF
  Top 0.254: R3.1 60.16,22.81 64.15,26.8 64.15,48.1 59.6,56.55 39.7,56.45 36.1,51.35 36.1,48.58 D7.A
  Top 1.016: R2.1 33.92,46.42 R10.2 | D7.A R2.1 | R2.1
RESET
  Top 0.254: IC1.3 42.75,21.35 43.65,20.45 43.65,12.3 JTAG.10
  Bottom 0.254: R4.1 43.39,14.72 43.42,14.75
  Bottom 0.61: 43.39,14.72 JTAG.10 43.43,12.05 47.15,12.05 47.57,12.47 C9.2
RXD  (via drill 0.5)
  Top 0.254: R41.2 26.25,18.65 v26.9,18 | v33.4,18.85 33.45,18.75 34.39,18.75 IC1.37
  Bottom 0.254: v26.9,18 30.65,18 31.5,18.85 v33.4,18.85
SCL  (via drill 0.5)
  Top 0.254: R37.2 v29.6,26.25 | IC1.15 38.93,25.58 v37.75,24.4
  Bottom 0.254: v29.6,26.25 35.95,26.25 v37.75,24.4
SDA  (via drill 0.5)
  Top 0.254: v35.2,24.05 36.2,24.05 38.43,26.28 IC1.16
  Bottom 0.254: R27.1 19.5,26.25 19.85,25.9 19.85,24.7 20.55,24 35.35,24 v35.2,24.05
SWCLK
  Top 0.254: IC1.29 34.06,23.84 34.35,23.55 34.35,20.35 33.6,19.6 32.8,19.6 32,18.8 32,15.45 34.1,13.35 34.1,11.5 34.55,11.05 36.4,11.05 JTAG.4
SWDIO
  Top 0.254: IC1.39 35.43,17.23 34.4,16.2 34.4,14.35 35.45,13.3 35.43,12.08 JTAG.2
TXD  (via drill 0.5)
  Top 0.254: IC1.36 32.84,20.35 31.6,20.35 30.75,19.5 v30.75,19.15
  Bottom 0.254: R30.1 30.25,18.65 v30.75,19.15
VCC_3V3  (via drill 0.5)  (4 unrouted)
  Top 0.254: 48.15,24.12 Q4.4 | 37.9,18.81 C11.2 | v39.75,23.8 39.79,23.84 IC1.8 46.04,23.84 46.2,24 46.18,24 Q4.1 | 58.26,45.48 C16.2
  Top 0.406: R22.2 58.26,45.48 | C16.2 58.24,46.66 v57.65,47.25 | v48.15,54.55 48.7,54.55 C15.2
  Top 0.61: C14.1 48.15,24.12 | Q4.4 Q4.1
  Top 0.813: R17.2 v52.75,28.5 54.3,28.5 55.75,29.95 55.75,32.09
  Top 1.016: SV1.11 29.07,12.28 v30.9,12.3 | 55.75,32.09 R7.2
  Bottom 0.254: 41.45,23.8 C4.2 | 37.97,18.75 IC1.44
  Bottom 0.406: v57.65,47.25 57.65,50.9 56.4,52.15 v50.3,52.15
  Bottom 0.61: 37.97,18.75 40.25,18.75 41.36,17.64 R4.2 43.1,17.68 45.35,17.68 R21.2
  Bottom 1.016: JTAG.1 35.37,10.02 C7.2 35.35,7.69 R11.2 30.9,7.71 v30.9,12.3 | 41.45,23.8 v39.75,23.8 37.91,21.96 37.91,19.35 | C11.2 37.91,19.35 | 37.9,19.34 37.91,19.35
  Bottom 1.27: 41.49,23.84 C4.2
  Bottom 1.422: v30.9,12.3 33.4,14.8 36.25,14.8 37.9,16.35 37.9,19.34 | 41.49,23.84 44.5,23.84 49.16,28.5 v52.75,28.5 54.3,28.5 60.55,34.75 60.55,50.75 56.75,54.55 v48.15,54.55
  pour Top (no thermals): 46.7,49.8 46.7,54.7 47.3,55.35 50.3,55.35 50.7,54.8 50.7,49.9 50.2,49.45 47.1,49.45
VCC_5V  (2 unrouted)

### Text on the board
tPlace: 5V | 3,3V | on BOT | +
tNames: LPC1115V0.10
tValues: auf Lötseite: